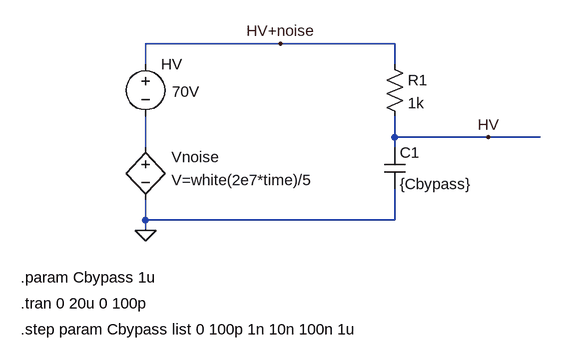
[diagram p0: schematic TransientNoiseExample.asc]
TransientNoiseExample.asc, the LTspice schematic file:
Version 4
SHEET 1 1316 680
WIRE 240 32 32 32
WIRE 416 32 240 32
WIRE 32 64 32 32
WIRE 416 64 416 32
WIRE 416 176 416 144
WIRE 560 176 416 176
WIRE 640 176 560 176
WIRE 32 192 32 144
WIRE 416 192 416 176
WIRE 32 304 32 272
WIRE 416 304 416 256
WIRE 416 304 32 304
WIRE 32 320 32 304
FLAG 32 320 0
FLAG 240 32 HV+noise
FLAG 560 176 HV
SYMBOL res 400 48 R0
SYMATTR InstName R1
SYMATTR Value 1k
SYMBOL bv 32 176 R0
WINDOW 0 40 31 Left 2
WINDOW 3 40 66 Left 2
SYMATTR InstName Vnoise
SYMATTR Value V=white(2e7*time)/5
SYMBOL voltage 32 48 R0
WINDOW 123 0 0 Left 2
WINDOW 39 0 0 Left 2
WINDOW 3 41 58 Left 2
SYMATTR InstName HV
SYMATTR Value 70V
SYMBOL cap 400 192 R0
SYMATTR InstName C1
SYMATTR Value {Cbypass}
TEXT -160 432 Left 2 !.tran 0 20u 0 100p
TEXT -160 392 Left 2 !.param Cbypass 1u
TEXT -160 472 Left 2 !.step param Cbypass list 0 100p 1n 10n 100n 1u

The netlist it stands for:
* TransientNoiseExample.asc
R1 HV+noise HV 1k
B§Vnoise N001 0 V=white(2e7*time)/5
V§HV HV+noise N001 70V
C1 HV 0 {Cbypass}
.tran 0 20u 0 100p
.param Cbypass 1u
.step param Cbypass list 0 100p 1n 10n 100n 1u
.backanno
.end

* Results of the author's LTspice run, read from the files saved beside the schematic
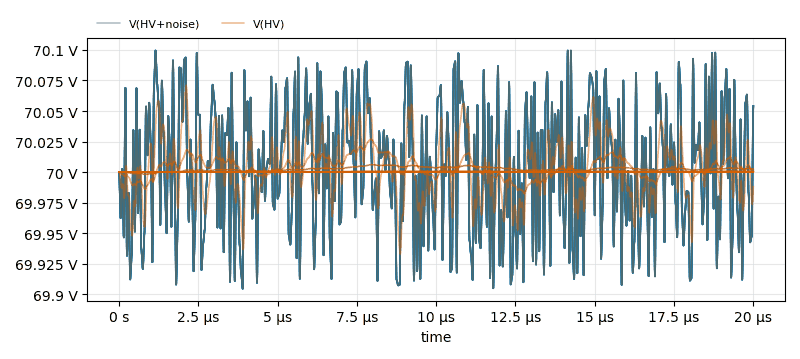
[diagram p1: Transient Analysis of TransientNoiseExample.asc, plotted from the saved traces]
* Transient Analysis, 6 runs:
*   V(HV+noise) [run 1]: min 69.9 V, max 70.1 V, average 70 V, rms 70 V, last 70.05 V
*   V(HV+noise) [run 2]: min 69.9 V, max 70.1 V, average 70 V, rms 70 V, last 70.05 V
*   V(HV+noise) [run 3]: min 69.9 V, max 70.1 V, average 70 V, rms 70 V, last 70.05 V
*   V(HV+noise) [run 4]: min 69.9 V, max 70.1 V, average 70 V, rms 70 V, last 70.05 V
*   V(HV+noise) [run 5]: min 69.9 V, max 70.1 V, average 70 V, rms 70 V, last 70.05 V
*   V(HV+noise) [run 6]: min 69.9 V, max 70.1 V, average 70 V, rms 70 V, last 70.05 V
*   V(HV) [run 1]: min 69.9 V, max 70.1 V, average 70 V, rms 70 V, last 70.05 V
*   V(HV) [run 2]: min 69.93 V, max 70.07 V, average 70 V, rms 70 V, last 69.99 V
*   V(HV) [run 3]: min 69.98 V, max 70.03 V, average 70 V, rms 70 V, last 70 V
*   V(HV) [run 4]: min 70 V, max 70.01 V, average 70 V, rms 70 V, last 70 V
*   V(HV) [run 5]: min 70 V, max 70 V, average 70 V, rms 70 V, last 70 V
*   V(HV) [run 6]: min 70 V, max 70 V, average 70 V, rms 70 V, last 70 V